# Altium project 2225_VumetreFrequencemetre.PrjPcb
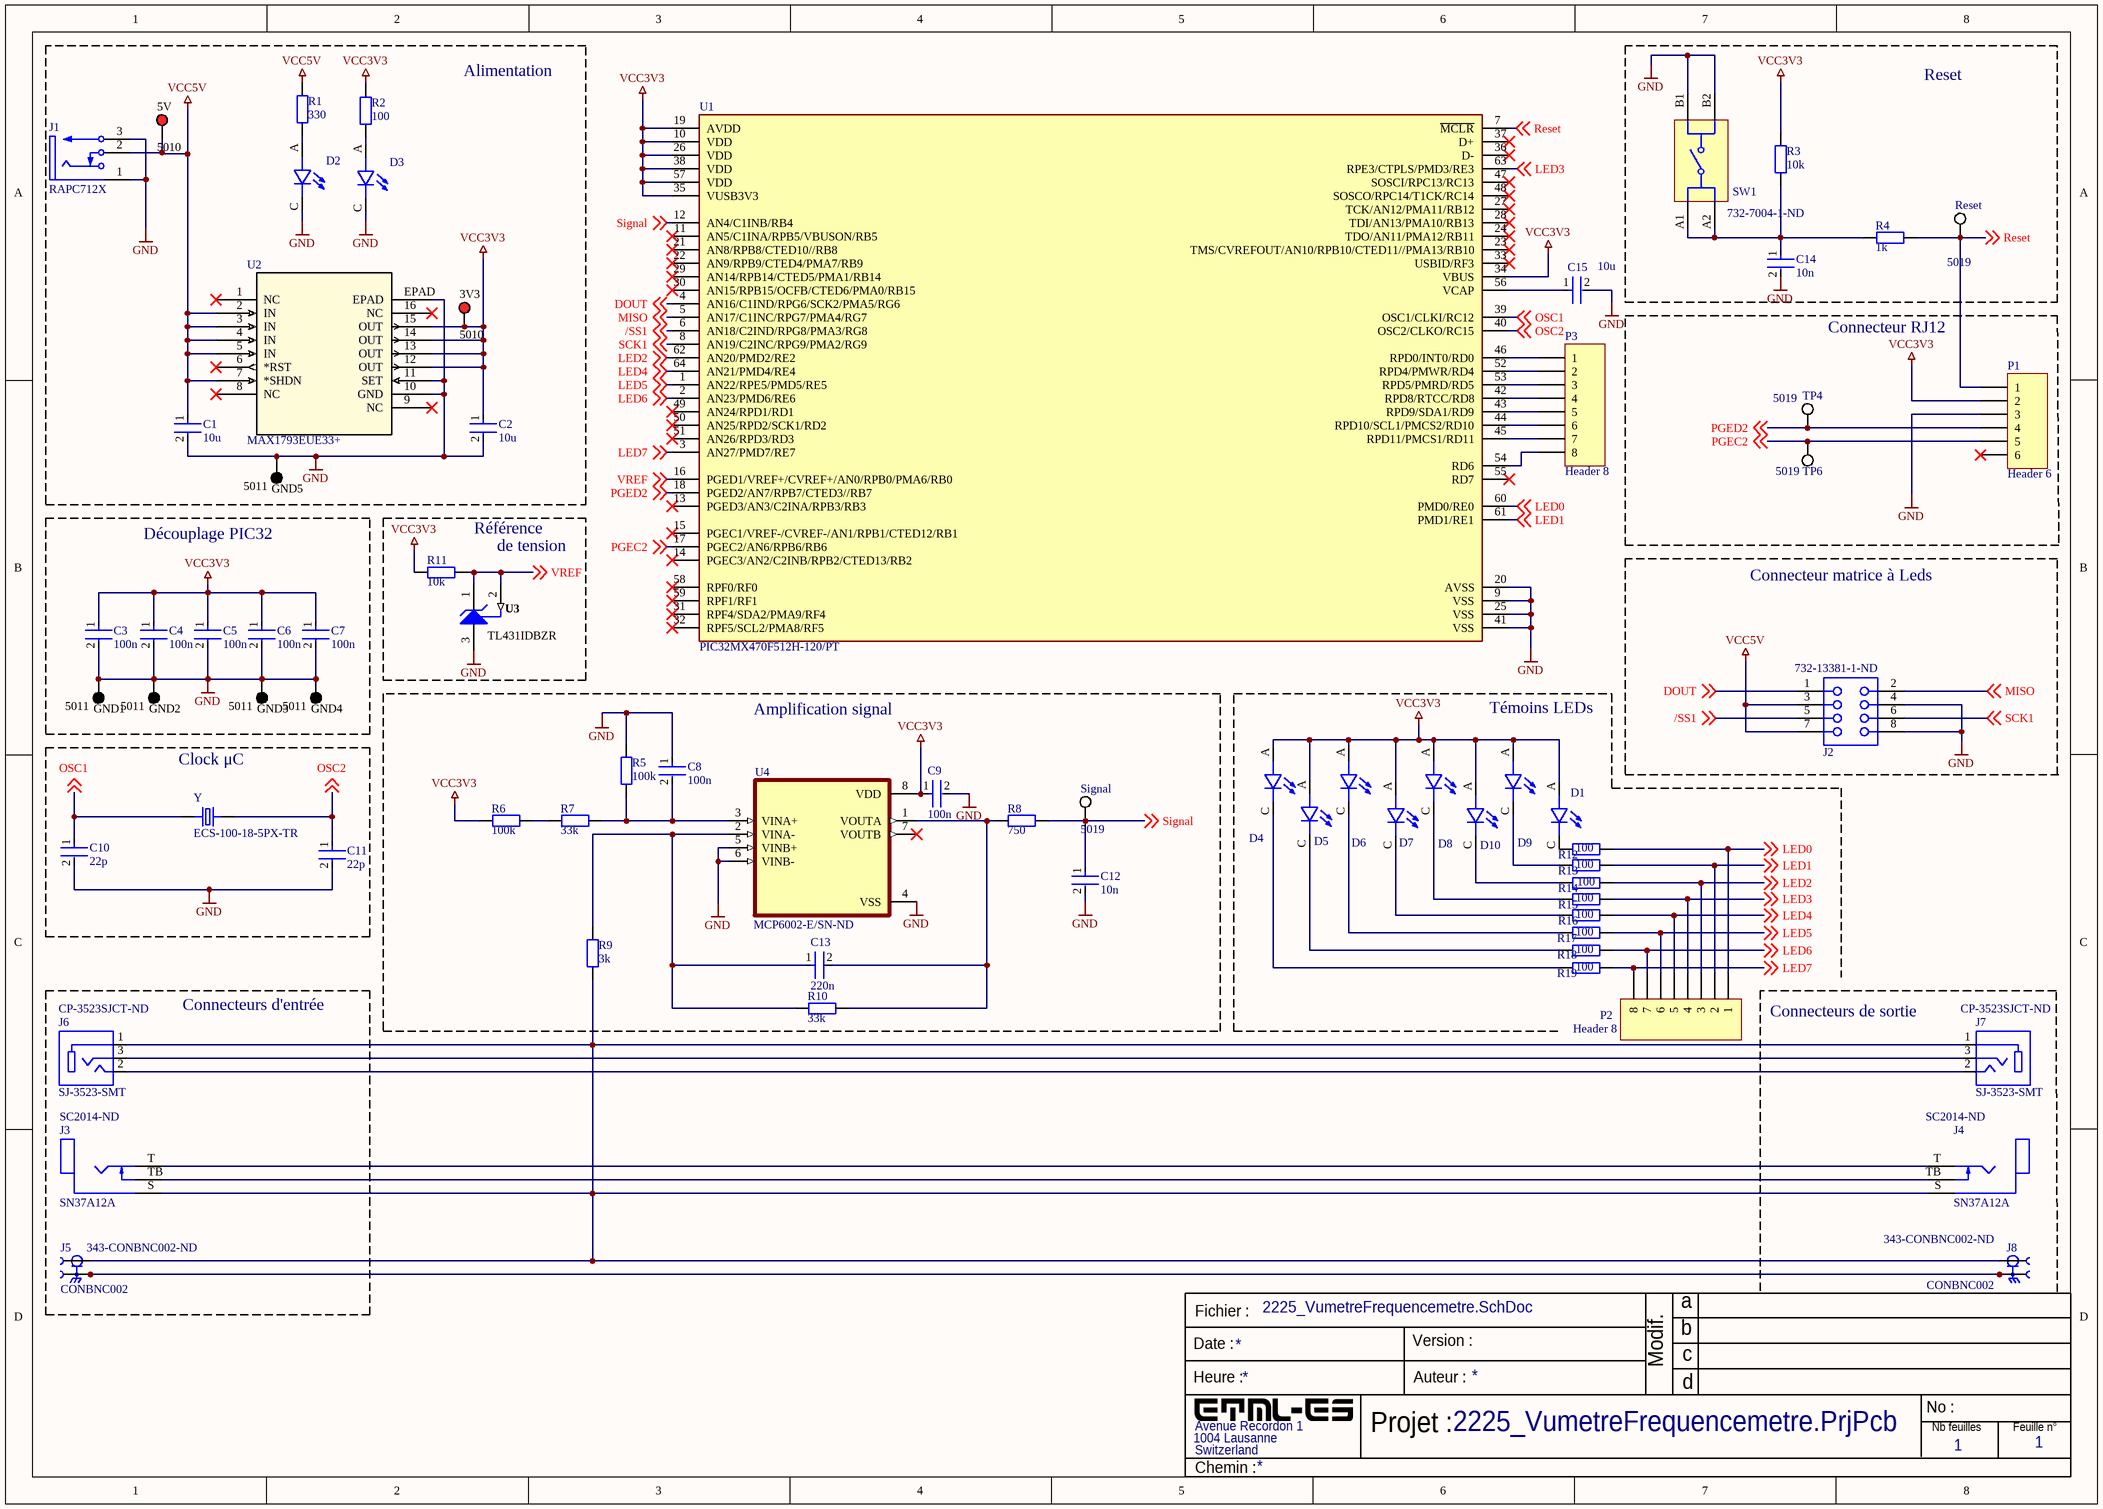
[diagram p0: 2225_VumetreFrequencemetre.SchDoc]
1 sheet, 72 parts. Net scope: global (net labels, ports and power ports of the same name join across sheets).
Board file: 2225_VumetreFrequencemetre.PcbDoc

## Sheet 2225_VumetreFrequencemetre.SchDoc
size A3; Organization: ETML-ES; Address1: Avenue Recordon 1; Address2: 1004 Lausanne; Address3: Switzerland; SheetNumber: 1; SheetTotal: 1

### Parts
3V3  5010  [KSTN-5010_V]
5V  5010  [KSTN-5010_V]
C1  10u  [FP-GRM21B-0_15-IPC_C]
C2  10u  [FP-GRM21B-0_15-IPC_C]
C3  100n  [FP-GRM21B-0_15-IPC_C]
C4  100n  [FP-GRM21B-0_15-IPC_C]
C5  100n  [FP-GRM21B-0_15-IPC_C]
C6  100n  [FP-GRM21B-0_15-IPC_C]
C7  100n  [FP-GRM21B-0_15-IPC_C]
C8  100n  [FP-GRM21B-0_15-IPC_C]
C9  100n  [FP-GRM21B-0_15-IPC_C]
C10  22p  [FP-GRM21B-0_15-IPC_C]
C11  22p  [FP-GRM21B-0_15-IPC_C]
C12  10n  [FP-GRM21B-0_15-IPC_C]
C13  220n  [FP-GRM21B-0_15-IPC_C]
C14  10n  [FP-GRM21B-0_15-IPC_C]
C15  10u  [FP-GRM21B-0_15-IPC_C]
D1  LTST-C191KFKT  [LEDC1608X55N]  (value not drawn)
D2  LTST-C191KFKT  [LEDC1608X55N]  (value not drawn)
D3  LTST-C191KFKT  [LEDC1608X55N]  (value not drawn)
D4  LTST-C191KFKT  [LEDC1608X55N]  (value not drawn)
D5  LTST-C191KFKT  [LEDC1608X55N]  (value not drawn)
D6  LTST-C191KFKT  [LEDC1608X55N]  (value not drawn)
D7  LTST-C191KFKT  [LEDC1608X55N]  (value not drawn)
D8  LTST-C191KFKT  [LEDC1608X55N]  (value not drawn)
D9  LTST-C191KFKT  [LEDC1608X55N]  (value not drawn)
D10  LTST-C191KFKT  [LEDC1608X55N]  (value not drawn)
GND1  5011  [KSTN-5011_V]
GND2  5011  [KSTN-5011_V]
GND3  5011  [KSTN-5011_V]
GND4  5011  [KSTN-5011_V]
GND5  5011  [KSTN-5011_V]
J1  RAPC712X  [SWITCH-RAPC712X-3_V]
J2  Supplier Part Number 1: 732-13381-1-ND  [61030821821]  (hidden comment: 61030821821)
J3  SN37A12A  Supplier Part Number 1: SC2014-ND  [SWITCHCRAFT_SN37A12A]
J4  SN37A12A  Supplier Part Number 1: SC2014-ND  [SWITCHCRAFT_SN37A12A]
J5  CONBNC002  Supplier Part Number 1: 343-CONBNC002-ND  [LINX_CONBNC002]
J6  SJ-3523-SMT  Supplier Part Number 1: CP-3523SJCT-ND  [CUI_SJ-3523-SMT]
J7  SJ-3523-SMT  Supplier Part Number 1: CP-3523SJCT-ND  [CUI_SJ-3523-SMT]
J8  CONBNC002  Supplier Part Number 1: 343-CONBNC002-ND  [LINX_CONBNC002]
P1  Header 6  [HDR1X6]
P2  Header 8  [HDR1X8]
P3  Header 8  [HDR1X8]
R1  330  [RESC2013X50X30ML20T20]
R2  100  [RESC2013X50X30ML20T20]
R3  10k  [RESC2013X50X30ML20T20]
R4  1k  [RESC2013X50X30ML20T20]
R5  100k  [RESC2013X50X30ML20T20]
R6  100k  [RESC2013X50X30ML20T20]
R7  33k  [RESC2013X50X30ML20T20]
R8  750  [RESC2013X50X30ML20T20]
R9  3k  [RESC2013X50X30ML20T20]
R10  33k  [RESC2013X50X30ML20T20]
R11  10k  [RESC2013X50X30ML20T20]
R12  100  [RESC2013X50X30ML20T20]
R13  100  [RESC2013X50X30ML20T20]
R14  100  [RESC2013X50X30ML20T20]
R15  100  [RESC2013X50X30ML20T20]
R16  100  [RESC2013X50X30ML20T20]
R17  100  [RESC2013X50X30ML20T20]
R18  100  [RESC2013X50X30ML20T20]
R19  100  [RESC2013X50X30ML20T20]
Reset  5019  [KSTN-5019_V]
Signal  5019  [KSTN-5019_V]
SW1  Supplier Part Number 1: 732-7004-1-ND  [WS-TASV_L6W6H4.3_4301x20438x6]  (hidden comment: 430182043816)
TP4  5019  [KSTN-5019_V]
TP6  5019  [KSTN-5019_V]
U1  Part Number: PIC32MX470F512H-120/PT  [Microchip_C04-085B_0]  (hidden comment: IC_Microchip_PIC32MX470F512H-120-PT_eec)
U2  MAX1793EUE33+  [21-0108_U16E+3_MXM]
U3  TL431IDBZR  [DBZ0003A_L]
U4  Supplier Part Number 1: MCP6002-E/SN-ND  [SOIC127P599X175-8N]  (hidden comment: MCP6002-E/SN)
Y  ECS-100-18-5PX-TR  [XTAL_ECS-100-18-5PX-TR]

### Blocks framed on the sheet
Alimentation: 3V3 5V C1 C2 D2 D3 GND5 J1 R1 R2 U2
Reset: C14 R3 R4 Reset SW1
Connecteur RJ12: P1 TP4 TP6
Découplage PIC32: C3-C7 GND1-GND4
Connecteur matrice à Leds: J2
Amplification signal: C8 C9 C12 C13 R5-R10 Signal U4
Clock μC: C10 C11 Y
Connecteurs d'entrée: J3 J5 J6

### Nets
GND: C1.2 C2.2 C3.2 C4.2 C5.2 C6.2 C7.2 C8.1 C9.2 C10.2 C11.2 C12.2 C14.2 C15.2 D2.C D3.C GND1.1 GND2.1 GND3.1 GND4.1 GND5.1 J1.1 J1.3 J2.4 J2.8 P1.3 R5.2 SW1.B1 SW1.B2 U1.9(VSS) U1.20(AVSS) U1.25(VSS) U1.41(VSS) U2.10(GND) U2.11(SET) U2.EPAD U3.3(ANODE) U4.4(VSS) U4.5(VINB+) U4.6(VINB-)
VCC3V3: 3V3.1 C2.1 C3.1 C4.1 C5.1 C6.1 C7.1 C9.1 D1.A D4.A D5.A D6.A D7.A D8.A D9.A D10.A P1.2 R2.1 R3.1 R6.1 R11.1 U1.10(VDD) U1.19(AVDD) U1.26(VDD) U1.34(VBUS) U1.35(VUSB3V3) U1.38(VDD) U1.57(VDD) U2.12(OUT) U2.13(OUT) U2.14(OUT) U2.15(OUT) U4.8(VDD)
VCC5V: 5V.1 C1.1 J1.2 J2.3 J2.7 R1.1 U2.2(IN) U2.3(IN) U2.4(IN) U2.5(IN) U2.7(*SHDN)
/SS1: J2.5 U1.6(AN18/C2IND/RPG8/PMA3/RG8) ; off-sheet /SS1
DOUT: J2.1 U1.4(AN16/C1IND/RPG6/SCK2/PMA5/RG6) ; off-sheet DOUT
LED0: P2.1 R12.2 U1.60(PMD0/RE0) ; off-sheet LED0
LED1: P2.2 R13.2 U1.61(PMD1/RE1) ; off-sheet LED1
LED2: P2.3 R14.2 U1.62(AN20/PMD2/RE2) ; off-sheet LED2
LED3: P2.4 R15.2 U1.63(RPE3/CTPLS/PMD3/RE3) ; off-sheet LED3
LED4: P2.5 R16.2 U1.64(AN21/PMD4/RE4) ; off-sheet LED4
LED5: P2.6 R17.2 U1.1(AN22/RPE5/PMD5/RE5) ; off-sheet LED5
LED6: P2.7 R18.2 U1.2(AN23/PMD6/RE6) ; off-sheet LED6
LED7: P2.8 R19.2 U1.3(AN27/PMD7/RE7) ; off-sheet LED7
MISO: J2.2 U1.5(AN17/C1INC/RPG7/PMA4/RG7) ; off-sheet MISO
OSC1: C10.1 U1.39(OSC1/CLKI/RC12) Y.1 ; off-sheet OSC1
OSC2: C11.1 U1.40(OSC2/CLKO/RC15) Y.2 ; off-sheet OSC2
PGEC2: P1.5 TP6.1 U1.17(PGEC2/AN6/RPB6/RB6) ; off-sheet PGEC2
PGED2: P1.4 TP4.1 U1.18(PGED2/AN7/RPB7/CTED3//RB7) ; off-sheet PGED2
Reset: P1.1 R4.2 Reset.1 U1.7(~{MCLR}) ; off-sheet Reset
SCK1: J2.6 U1.8(AN19/C2INC/RPG9/PMA2/RG9) ; off-sheet SCK1
Signal: C12.1 R8.2 Signal.1 U1.12(AN4/C1INB/RB4) ; off-sheet Signal
VREF: R11.2 U1.16(PGED1/VREF+/CVREF+/AN0/RPB0/PMA6/RB0) U3.1(CATHODE) U3.2(REF) ; off-sheet VREF
NetC8_2: C8.2 R5.1 R7.2 U4.3(VINA+)
NetC13_1: C13.1 R9.2 R10.1 U4.2(VINA-)
NetC13_2: C13.2 R8.1 R10.2 U4.1(VOUTA)
NetC14_1: C14.1 R3.2 R4.1 SW1.A1 SW1.A2
NetC15_1: C15.1 U1.56(VCAP)
NetD1_C: D1.C R12.1
NetD2_A: D2.A R1.2
NetD3_A: D3.A R2.2
NetD4_C: D4.C R19.1
NetD5_C: D5.C R18.1
NetD6_C: D6.C R17.1
NetD7_C: D7.C R16.1
NetD8_C: D8.C R15.1
NetD9_C: D9.C R13.1
NetD10_C: D10.C R14.1
NetJ3_S: J3.S J4.S J5.1 J6.1 J7.1 J8.1 R9.1
NetJ3_T: J3.T J4.T
NetJ3_TB: J3.TB J4.TB
NetJ5_2: J5.2 J5.S1 J5.S2 J8.2 J8.S1 J8.S2
NetJ6_2: J6.2 J7.2
NetJ6_3: J6.3 J7.3
NetP3_1: P3.1 U1.46(RPD0/INT0/RD0)
NetP3_2: P3.2 U1.52(RPD4/PMWR/RD4)
NetP3_3: P3.3 U1.53(RPD5/PMRD/RD5)
NetP3_4: P3.4 U1.42(RPD8/RTCC/RD8)
NetP3_5: P3.5 U1.43(RPD9/SDA1/RD9)
NetP3_6: P3.6 U1.44(RPD10/SCL1/PMCS2/RD10)
NetP3_7: P3.7 U1.45(RPD11/PMCS1/RD11)
NetP3_8: P3.8 U1.54(RD6)
NetR6_2: R6.2 R7.1

Not connected (* = marked no-connect by the designer): P1 6*; U1 11(AN5/C1INA/RPB5/VBUSON/RB5)* 13(PGED3/AN3/C2INA/RPB3/RB3)* 14(PGEC3/AN2/C2INB/RPB2/CTED13/RB2)* 15(PGEC1/VREF-/CVREF-/AN1/RPB1/CTED12/RB1)* 21(AN8/RPB8/CTED10//RB8)* 22(AN9/RPB9/CTED4/PMA7/RB9)* 23(TMS/CVREFOUT/AN10/RPB10/CTED11//PMA13/RB10)* 24(TDO/AN11/PMA12/RB11)* 27(TCK/AN12/PMA11/RB12)* 28(TDI/AN13/PMA10/RB13)* 29(AN14/RPB14/CTED5/PMA1/RB14)* 30(AN15/RPB15/OCFB/CTED6/PMA0/RB15)* 31(RPF4/SDA2/PMA9/RF4)* 32(RPF5/SCL2/PMA8/RF5)* 33(USBID/RF3)* 36(D-)* 37(D+)* 47(SOSCI/RPC13/RC13)* 48(SOSCO/RPC14/T1CK/RC14)* 49(AN24/RPD1/RD1)* 50(AN25/RPD2/SCK1/RD2)* 51(AN26/RPD3/RD3)* 55(RD7)* 58(RPF0/RF0)* 59(RPF1/RF1)*; U2 1(NC)* 6(*RST)* 8(NC)* 9(NC)* 16(NC)*; U4 7(VOUTB)*

### Notes on the sheet
- (near R11) Référence
- de tension
- (near D9) Témoins LEDs
- Connecteurs de sortie
- Fichier :
- a
- Date :
- Heure :
- Version :
- Auteur :
- Modif.
- b
- c
- d
- Projet :
- No :
- Nb feuilles
- Feuille n°
- Chemin :

### Library data of the parts
3V3 5V = CMP-1672-00002-4: Test Point, Red, Through Hole, RoHS, Bulk; Manufacturer: Keystone; Contact Material: Bronze; Mounting Technology: Through Hole; RoHSCompliant: true; Pins: 1; Package Quantity: 100; ComponentLink2Description: Datasheet; Height: 8.12 mm; ComponentLink1URL: http://www.keyelco.com/; DatasheetVersion: Rev. F, 12/2013; Mount: Through Hole; PackageReference: 5010; Contact Plating: Silver; Packaging: Bulk; Colour: Red; REACH SVHC: No SVHC; PackageDescription: 1-Pin Through Hole Device, Dia 3.17 mm; ComponentLink2URL: http://www.keyelco.com/product-pdf.cfm?p=1319; ComponentLink1Description: Manufacturer URL
C1-C15 = CMP-2007-03541-2: Chip Multilayer Ceramic Capacitors for General Purpose, 0805, 10uF, X5R, 15%, 10%, 25V; Length: 2mm; Depth: 1.25mm; Termination: SMD/SMT; Voltage: 25V; Height: 1.25mm; Material: Ceramic; Thickness: 0.053inch; Radiation Hardening: No; Min Operating Temperature: -55°C; Width: 0.049inch; Package Quantity: 1; Mount: Surface Mount; Dielectric: X5R; Packaging: Tape and Reel; Capacitance: 10uF; Voltage Rating (DC): 25V; Lead Free: Lead Free; Max Operating Temperature: 85°C; Case Code (Imperial): 0805; Case/Package: 0805; Tolerance: 10%; Voltage Rating: 25V; Case Code (Metric): 2012
D1-D10 = LTST-C191KFKT: Orange 605nm LED Indication - Discrete 2V 0603 (1608 Metric); MF: Lite-On Inc.; Check_prices: https://www.snapeda.com/parts/LTST-C191KFKT/Lite-On+Inc./view-part/?ref=eda; Availability: In Stock; Price: None; Package: 0603 Lite-On; MP: LTST-C191KFKT; Value: *; SnapEDA_Link: https://www.snapeda.com/parts/LTST-C191KFKT/Lite-On+Inc./view-part/?ref=snap; Purchase-URL: https://pricing.snapeda.com/search/part/LTST-C191KFKT/?ref=eda
GND1-GND5 = CMP-1672-00003-4: Test Point, Black, Through Hole, RoHS, Bulk; Manufacturer: Keystone; ComponentLink2URL: http://www.keyelco.com/product-pdf.cfm?p=1320; Colour: Black; Pins: 1; REACH SVHC: No SVHC; ComponentLink1URL: http://www.keyelco.com/; PackageReference: 5011; Contact Plating: Silver; Package Quantity: 100; Packaging: Bulk; RoHSCompliant: true; Height: 8.12 mm; PackageDescription: 1-Pin Through Hole Device, Dia 3.17 mm; Mount: Through Hole; Mounting Technology: Through Hole; DatasheetVersion: Rev. F, 12/2013; ComponentLink1Description: Manufacturer URL; Contact Material: Bronze; ComponentLink2Description: Datasheet
J1 = CMP-2000-05383-1: Conn Powerjack Mini R/A PCMT, 5 A, 3-Pin THD, RoHS; Manufacturer: Switchcraft; Gender: Male; Current Rating: 5A; Connector Type: Jack; Dynamic Catalog: SwitchcraftInc; Other Names: Q2387461 / Q2526383 / RAPC712X-ND / SC237; Internal Switch(s): SingleSwitch,NormallyClosed; Catalog Drawings: RAPC7(1,2)2XSide / RAPC7(1,2)2XTop; Plug/Mating Plug Diameter: 2.5mmID,5.5mmOD; Number of Positions/Contacts: 2Conductors,2Contacts; Shielding: Unshielded; Mating Products: SC1539-ND / -CONNPLUGMINIPWR2CONDBLK/RED / SC1051-ND / -CONNPLUGMINIPOWER2CONDBLACK; Mounting Type: ThroughHole,RightAngle; Manufacturer URL: http://www.switchcraft.com/; Contact Material: Brass; Standard Package: 2,500; RoHS Information: SwitchcraftRoHSInfo; Termination: SolderEyelet(s); Housing Color: Black; Datasheet Version: Rev. A, 08/2005; Family: Barrel-PowerConnectors; Housing Material: Thermoplastic; Color: Black; Datasheet URL: https://datasheet.ciiva.com/391/rapc712x-cd-391666.pdf; Category: Connectors,Interconnects; Contact Material - Plating: Nickel
J2 = 61030821821: WR-PHD Socket Header, SMT, Vertical, pitch 2.54mm, 2 Row, 8P; Manufacturer: Wurth Elektronik; Contact Resistance: 20mΩ; Rated Current: 3A; Working Voltage: 250V; Withstanding Voltage: 600V; ComponentLink1Description: Website Link; ComponentLink1URL: https://www.we-online.com/redexpert/article/61030821821?ad; ComponentLink2Description: Datasheet Link; ComponentLink2URL: https://www.we-online.com/redexpert/spec/61030821821?ad; Manufacturer Part Number: 61030821821; Category: Board-to-Board Connectors; Match Code: WR-PHD; Mount: Surface Mount; Operating Temperature Max: 105°C; Operating Temperature Min: -40°C; Packaging: Tape and Reel; Gender: Socket Header; Number of Pins: 8; Number of Rows: 2; Orientation: Vertical; Pitch: 2.54mm; Supplier 1: Digi-Key
J3 J4 = SN37A12A: Connecteur Jack 6.35mm; Package: None; Price: None; Value: *; MP: SN37A12A; Availability: Unavailable; Supplier 1: Digi-Key
J5 J8 = CONBNC002: BNC Connector Jack, Female Socket 50Ohm Panel Mount, Through Hole, Right Angle Solder; MF: Linx Technologies Inc.; SnapEDA_Link: https://www.snapeda.com/parts/CONBNC002/Linx/view-part/?ref=snap; Package: None; Check_prices: https://www.snapeda.com/parts/CONBNC002/Linx/view-part/?ref=eda; MP: CONBNC002; Value: *; Availability: In Stock; Purchase-URL: https://pricing.snapeda.com/search/part/CONBNC002/?ref=eda; Price: None; Supplier 1: Digi-Key
J6 J7 = SJ-3523-SMT: 3.50mm _0.141, 1/8, Mini Plug_ - Headphone Phone Jack Stereo _3 Conductor, TRS_ Connector Solder; MF: CUI Devices; Package: None; Availability: Unavailable; Value: *; MP: SJ-3523-SMT; SnapEDA_Link: https://www.snapeda.com/parts/SJ-3523-SMT/CUI%20Devices/view-part/278287/?ref=snap; Price: None; Supplier 1: Digi-Key
P1 = Header 6: Header, 6-Pin; LatestRevisionDate: 17-Jul-2002; LatestRevisionNote: Re-released for DXP Platform.; Publisher: Altium Limited
P2 P3 = Header 8: Header, 8-Pin; LatestRevisionDate: 17-Jul-2002; LatestRevisionNote: Re-released for DXP Platform.; Publisher: Altium Limited
R1-R19 = CMP-2001-04896-1: Manufacturer: Vishay Dale; Part Number: CRCW08050000Z0EA
Reset Signal TP4 TP6 = CMP-1672-00008-1: Test Point, 1 Position SMD, RoHS, Tape and Reel; ComponentLink1Description: Manufacturer URL; Package Quantity: 1000; DatasheetVersion: 03/2014; Packaging: Tape and Reel; ComponentLink2URL: http://www.keyelco.com/product-pdf.cfm?p=1357; ComponentLink1URL: http://www.keyelco.com/; Mount: Surface Mount; Contact Plating: Silver; PackageDescription: 1-Pin Surface Mount Device, Body 3.81 x 2.03 mm; Pins: 1; RoHSCompliant: True; Mounting Technology: Surface Mount; ComponentLink2Description: Datasheet; PackageReference: 5019
SW1 = 430182043816: WS-TASV SMT Tact Switch, L6 x W6 x H4.3mm, 160g, SPST-NO, 12V, 50mA; Manufacturer: Wurth Elektronik; Washable: No; Manufacturer Part Number: 430182043816; Category: Tact Switches; Match Code: WS-TASV; ComponentLink1Description: Website Link; ComponentLink1URL: https://www.we-online.com/redexpert/article/430182043816?ad; ComponentLink2Description: Datasheet Link; ComponentLink2URL: https://www.we-online.com/redexpert/spec/430182043816?ad; Mount: Surface Mount; Operating Temperature Max: 85°C; Operating Temperature Min: -40°C; Packaging: Tape and Reel; Length: 6mm; Width: 6mm; Height: 4.3mm; Circuit: SPST-NO; Contact Material: Stainless Steel; Contact Plating: Silver; Operation Force: 160g; Rated Current: 50mA; Rated Voltage (DC): 12V; Terminal Material: Copper Alloy; Terminal Plating: Silver; Supplier 1: Digi-Key
U1 = IC_Microchip_PIC32MX470F512H-120-PT_eec: IC MCU 32BIT 512KB FLASH 64TQFP; Mfg Package Ident: C04-085B; helpURL: https://upverter.com/upn/revision/9274a2e649b597c2/; ComponentLink2Description: Datasheet; Temperature: 0°C to +70°C; Package: C04-085B; Supplier 2: Mouser; Price: 5.64420643681; Supplier 1: Digi-Key; ComponentLink1URL: https://upverter.com/upn/revision/9274a2e649b597c2/; Supplier Part Number 2: 579-MX470F512H120PT; Supplier Part Number 1: PIC32MX470F512H-120/PT-ND; Manufacturer: Microchip; ComponentLink1Description: Upverter; ComponentLink2URL: http://ww1.microchip.com/downloads/en/DeviceDoc/60001185D.pdf; RoHS: TRUE; Mouser Part Number: 579-MX470F512H120PT; Temperature Range High: +70°C; Digikey Description: IC MCU 32BIT 512KB FLASH 64TQFP; Digikey Part Number: PIC32MX470F512H-120/PT-ND; Lead Free: yes; Temperature Range Low: 0°C
U2 = MAX1793EUE33+: No Description Available; Mfr_Name: Analog Devices Inc; Copyright: Copyright (C) 2023 Ultra Librarian. All rights reserved.; Manufacturer_Part_Number: MAX1793EUE33+; Digi-Key_Part_Number_1: MAX1793EUE33+-ND; RefDes: RefDes; Type: DEV
U3 = CMP-0366-01140-2: Adjustable Precision Shunt Regulator, 34 ppm / degC, 100 mA, -40 to 85 degC, 3-pin SOT-23 (DBZ), Green (RoHS & no Sb/Br); Manufacturer: Texas Instruments; VO Adj(Max)(V): 36; VO Adj(Min)(V): 2.495; Temp Coeff(Max)(ppm/ degree C): 92; Iout/Iz(Max)(mA): 100; Temp Coeff(Typ)(ppm/ degree C): 34; Rating: Military; Initial Accuracy @ 25/deg C(%): 2; SubFamily: Shunt Voltage Reference; Min Iz for Regulation(uA): 600; Eco-Plan: Green (RoHS & no Sb/Br); ComponentLink3URL: http://www.ti.com/litv/pdf/mpds108a; ComponentLink3Description: Package Specification; ComponentLink1Description: Manufacturer URL; Code_JEDEC: TO-236; PartNumber: TL431IDBZR; PackageReference: DBZ0003A; ComponentLink1URL: http://www.ti.com/; ComponentLink2URL: http://www.ti.com/general/docs/lit/getliterature.tsp?genericPartNumber=TL431&fileType=pdf; DatasheetVersion: SLVS543M; ComponentLink2Description: Datasheet; PackageVersion: 4203227/B; Mounting Technology: Surface Mount; PackageDescription: 3-Pin Plastic Small Outline, Body 2.92 x 1.3 mm, Pitch 0.95 mm
U4 = MCP6002-E/SN: General Purpose Amplifier 2 Circuit Rail-to-Rail 8-SOIC; MF: Microchip; Value: *; MP: MCP6002-E/SN; SnapEDA_Link: https://www.snapeda.com/parts/MCP6002-E/SN/Microchip/view-part/299798/?ref=snap; Availability: Unavailable; Package: SOIC-8 Microchip; Price: None; Supplier 1: Digi-Key
Y = ECS-100-18-5PX-TR: 10MHz Â±30ppm Crystal 18pF 50 Ohms HC-49/US; MF: ECS Inc.; Digi-Key_Part_Number: XC1288CT-ND; SnapEDA_Link: https://www.snapeda.com/parts/ECS-100-18-5PX-TR/ECS%20Inc./view-part/2455545/?ref=snap; Package: HC49/US ECS International; MP: ECS-100-18-5PX-TR; Digi-Key_Purchase_URL: https://www.digikey.com/product-detail/en/ecs-inc/ECS-100-18-5PX-TR/XC1288CT-ND/827752?utm_source=snapeda&utm_medium=aggregator&utm_campaign=symbol; Value: *